# EAGLE design Page1 (EAGLE 4.16)
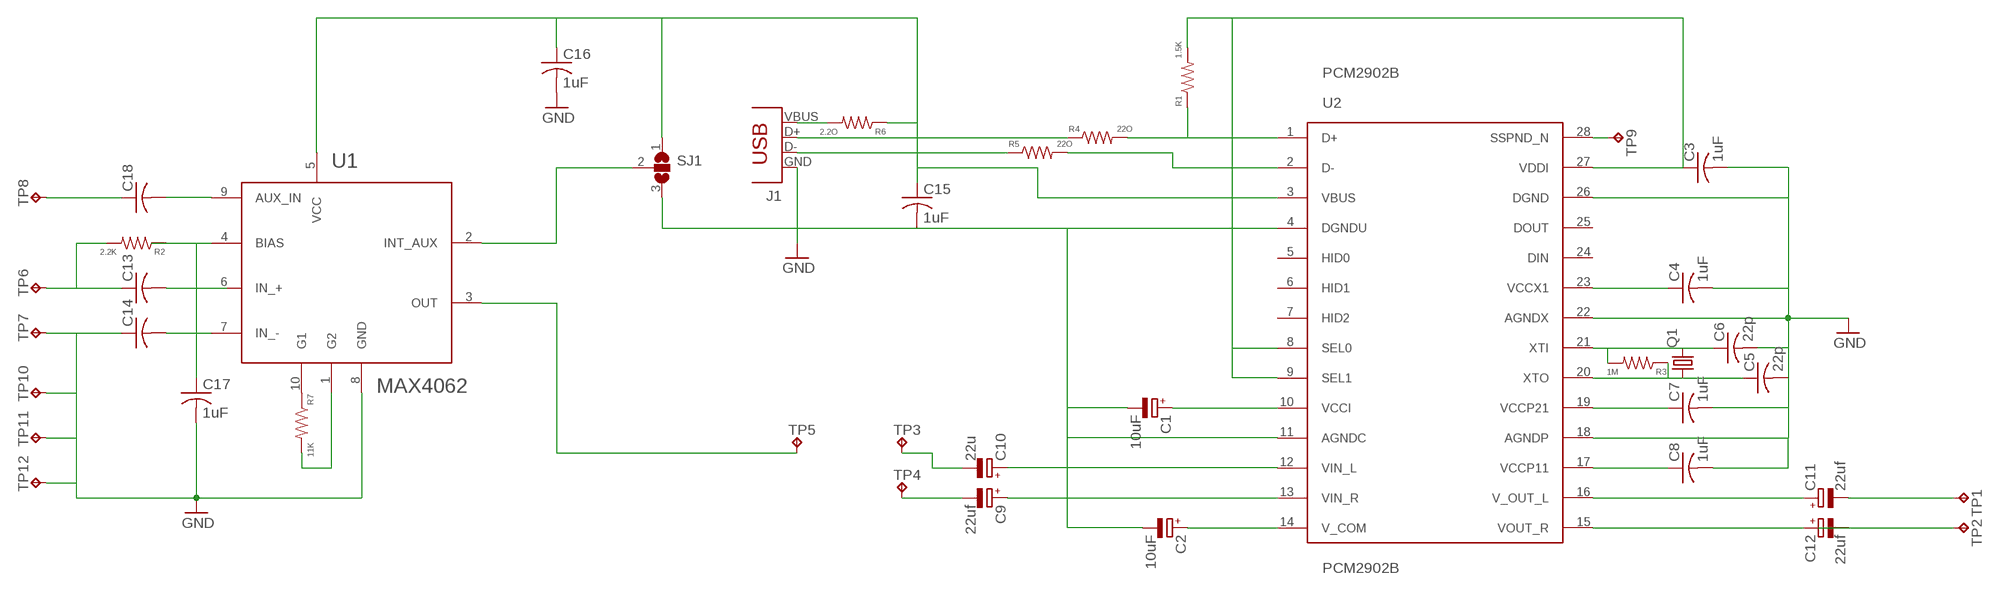
[diagram p0: schematic, sheet 1]

## Parts
C1  10uF  CPOL-EUSMCA  [SMC_A]
C2  10uF  CPOL-EUSMCA  [SMC_A]
C3  1uF  C-USC0805  [C0805]
C4  1uF  C-USC0805  [C0805]
C5  22p  C-USC1206  [C1206]
C6  22p  C-USC1206  [C1206]
C7  1uF  C-USC0805  [C0805]
C8  1uF  C-USC0805  [C0805]
C9  22uf  CPOL-EUSMCB  [SMC_B]
C10  22u  CPOL-EUSMCB  [SMC_B]
C11  22uf  CPOL-EUSMCB  [SMC_B]
C12  22uf  CPOL-EUSMCB  [SMC_B]
C13  C-USC0603  [C0603]
C14  C-USC0603  [C0603]
C15  1uF  C-USC0805  [C0805]
C16  1uF  C-USC0805  [C0805]
C17  1uF  C-USC0805  [C0805]
C18  C-USC0603  [C0603]
J1  USB_BHOR  [USB_B-HOR]
Q1  CRYSTALHC49S  [HC49/S]
R1  1.5K  R-US_R0805  [R0805]
R2  2.2K  R-US_R0805  [R0805]
R3  1M  R-US_R0603  [R0603]
R4  22O  R-US_R0805  [R0805]
R5  22O  R-US_R0805  [R0805]
R6  2.2O  R-US_R0805  [R0805]
R7  11K  R-US_R0603  [R0603]
SJ1  SJ2W  [SJ_2]
TP1  TPPAD1-13  [P1-13]
TP2  TPPAD1-13  [P1-13]
TP3  TPPAD1-13  [P1-13]
TP4  TPPAD1-13  [P1-13]
TP5  TPPAD1-13  [P1-13]
TP6  TPPAD1-13  [P1-13]
TP7  TPPAD1-13  [P1-13]
TP8  TPPAD1-13  [P1-13]
TP9  TPPAD1-13  [P1-13]
TP10  TPPAD1-13  [P1-13]
TP11  TPPAD1-13  [P1-13]
TP12  TPPAD1-13  [P1-13]
U1  MAX4062  [UMAX_10]
U2  PCM2902B  [SSOP28DB]

## Nets
AUX_IN: C18.2 U1.9(AUX_IN)
D+: R1.1 R4.2 U2.1(D+)
D+IN: J1.D+ R4.1
D-: R5.2 U2.2(D-)
GND: C1.- C2.- C3.2 C4.2 C5.2 C6.2 C7.2 C8.2 C14.1 C15.2 C16.2 C17.2 J1.GND SJ1.3 TP7.1(TP) TP10.1(TP) TP11.1(TP) TP12.1(TP) U1.8(GND) U2.4(DGNDU) U2.11(AGNDC) U2.18(AGNDP) U2.22(AGNDX) U2.26(DGND)
INT_AUX: SJ1.2 U1.2(INT_AUX)
N$1: C6.1 Q1.2 R3.2 U2.21(XTI)
N$2: C5.1 Q1.1 R3.1 U2.20(XTO)
N$3: J1.D- R5.1
N$4: C4.1 U2.23(VCCX1)
N$5: C7.1 U2.19(VCCP21)
N$6: TP9.1(TP) U2.28(SSPND_N)
N$7: C8.1 U2.17(VCCP11)
N$8: C11.+ U2.16(V_OUT_L)
N$12: C3.1 R1.2 U2.8(SEL0) U2.9(SEL1) U2.27(VDDI)
N$13: C11.- TP1.1(TP)
N$15: C1.+ U2.10(VCCI)
N$16: C2.+ U2.14(V_COM)
N$17: C10.+ U2.12(VIN_L)
N$18: C9.+ U2.13(VIN_R)
N$19: C12.+ U2.15(VOUT_R)
N$20: C12.- TP2.1(TP)
N$22: C10.- TP3.1(TP)
N$23: C9.- TP4.1(TP)
N$24: C13.2 U1.6(IN_+)
N$25: C14.2 U1.7(IN_-)
N$26: C13.1 R2.2 TP6.1(TP)
N$27: C17.1 R2.1 U1.4(BIAS)
N$28: R7.1 U1.10(G1)
N$29: R7.2 U1.1(G2)
N$31: C18.1 TP8.1(TP)
PRE_OUT: TP5.1(TP) U1.3(OUT)
VBUS: C15.1 C16.1 R6.1 SJ1.1 U1.5(VCC) U2.3(VBUS)
VBUS_IN: J1.VBUS(V_BUS) R6.2
Unconnected: U2.5(HID0) U2.6(HID1) U2.7(HID2) U2.24(DIN) U2.25(DOUT)

## Library data of the parts
C1 C2 C9-C12 = rcl:CPOL-EU: POLARIZED CAPACITOR, European symbol
C3-C8 C13-C18 = rcl:C-US: CAPACITOR, American symbol
J1 = Stofer:USB_B: BERG USB connector
Q1 = crystal:CRYSTAL: CRYSTAL
R1-R7 = rcl:R-US_: RESISTOR, American symbol
SJ1 = jumper:SJ2W: SMD solder JUMPER
TP1-TP12 = Stofer:TP
U1 = Stofer:MAX4062
U2 = Stofer:PCM2902B

## Board
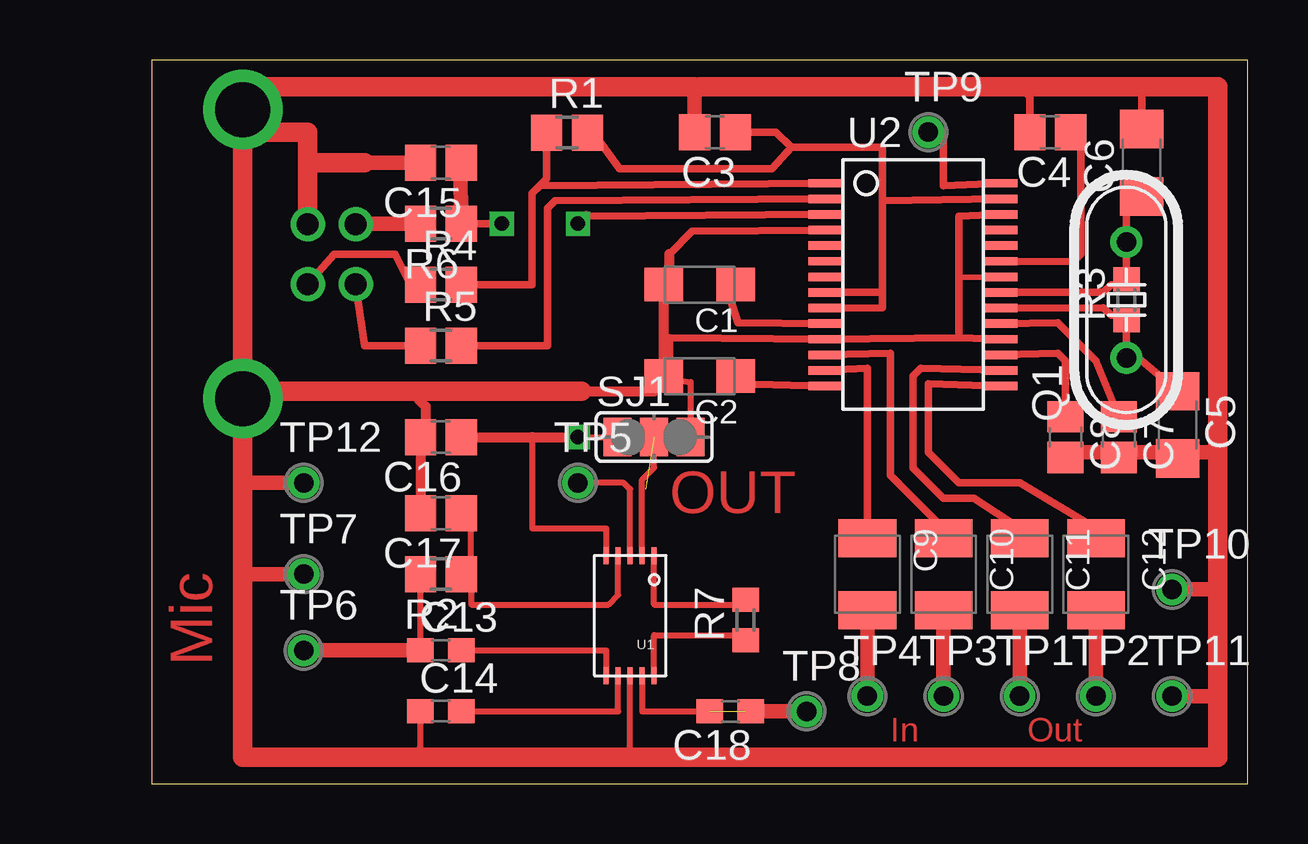
[diagram p1: board, top side]
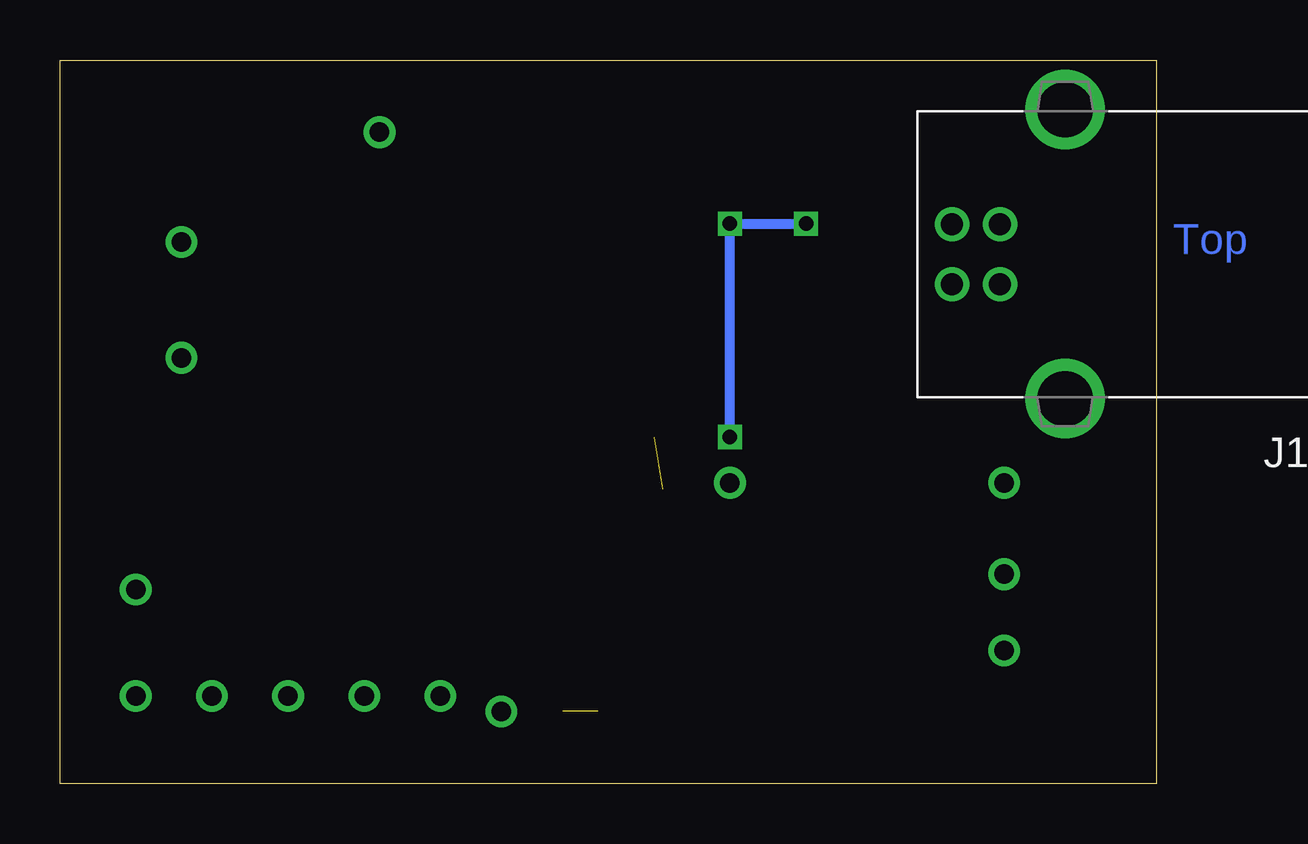
[diagram p2: board, bottom side, seen from below]

Size 45.7 x 30.15 mm. Coordinates in mm from the lower left corner, seen from the top.
Outline: 0,0 45.7,0 45.7,30.15 0,30.15 0,0
Copper layers (1*2+15*16): Top 0.035mm / dielectric 0.2mm / Route2 0.035mm / dielectric 0.15mm / Route15 0.035mm / dielectric 0.2mm / Bottom 0.035mm
Design rules "default": minimum track width 10mil, minimum drill 24mil, track to track 8mil, track to pad 8mil, pad to pad 8mil, via to via 8mil, smd to smd 8mil, copper to edge 40mil, drill to drill 8mil, minimum pad ring 10mil, minimum via ring 8mil, stop-mask expansion 4mil, vias tented up to drill 0mil, thermal gap 10mil

### Footprints (pad centres in the part's own frame; a part is rotated, then mirrored left to right if it is on the bottom)
SMC_A = smd 1.6 x 1.4: + -1.5,0; - 1.5,0
C0805 = smd 1.3 x 1.5: 1 -0.85,0; 2 0.85,0
C1206 = smd 1.6 x 1.8: 1 -1.4,0; 2 1.4,0
SMC_B = smd 1.6 x 2.4: + -1.5,0; - 1.5,0
C0603 = smd 1.1 x 1: 1 -0.85,0; 2 0.85,0
USB_B-HOR = drill 0.92 pad 1.27 round: D+ 2.71,1.25; D- 4.71,1.25; GND 2.71,-1.25; VBUS 4.71,-1.25 | drill 2.3 pad 3 round: M1 0,6.02; M2 0,-6.02
HC49/S = drill 0.813 round: 1 -2.413,0; 2 2.413,0
R0805 = smd 1.3 x 1.5: 1 -0.85,0; 2 0.85,0
R0603 = smd 1 x 1.1: 1 -0.85,0; 2 0.85,0
SJ_2 = smd 1.168 x 1.6: 1 -1.524,0; 2 0,0; 3 1.524,0
P1-13 = drill 0.813 round: 1 0,0
UMAX_10 = smd 0.2 x 0.7: 1 0,0.5; 2 0.5,0.5; 3 1,0.5; 4 1.5,0.5; 5 2,0.5; 6 2,5.5; 7 1.5,5.5; 8 1,5.5; 9 0.5,5.5; 10 0,5.5
SSOP28DB = smd 0.348 x 1.397: 1 -4.225,-3.656; 2 -3.575,-3.656; 3 -2.925,-3.656; 4 -2.275,-3.656; 5 -1.625,-3.656; 6 -0.975,-3.656; 7 -0.325,-3.656; 8 0.325,-3.656; 9 0.975,-3.656; 10 1.625,-3.656; 11 2.275,-3.656; 12 2.925,-3.656; 13 3.575,-3.656; 14 4.225,-3.656; 15 4.225,3.656; 16 3.575,3.656; 17 2.925,3.656; 18 2.275,3.656; 19 1.625,3.656; 20 0.975,3.656; 21 0.325,3.656; 22 -0.325,3.656; 23 -0.975,3.656; 24 -1.625,3.656; 25 -2.275,3.656; 26 -2.925,3.656; 27 -3.575,3.656; 28 -4.225,3.656

### Placement (x,y rotation side)
C1  22.86,20.79 180 top
C2  22.86,16.98 180 top
C3  23.49,27.14 180 top
C4  37.46,27.14 180 top
C5  42.77,14.95 270 top
C6  41.27,25.87 90 top
C7  40.32,14.44 270 top
C8  38.09,14.44 270 top
C9  29.84,8.72 270 top
C10  33.02,8.72 270 top
C11  36.19,8.72 270 top
C12  39.36,8.72 270 top
C13  12.06,5.55 0 top
C14  12.06,3.01 0 top
C15  12.06,25.87 180 top
C16  12.06,14.44 180 top
C17  12.06,11.27 180 top
C18  24.12,3.01 180 top
J1  3.81,22.06 180 bottom
Q1  40.63,20.16 90 top
R1  17.32,27.13 0 top
R2  12.06,8.72 180 top
R3  40.63,20.16 90 top
R4  12.06,20.79 0 top
R5  12.06,18.25 0 top
R6  12.06,23.33 180 top
R7  24.76,6.82 90 top
SJ1  20.95,14.44 0 top
TP1  36.19,3.64 0 top
TP2  39.36,3.64 0 top
TP3  33.02,3.64 0 top
TP4  29.84,3.64 0 top
TP5  17.78,12.54 0 top
TP6  6.34,5.55 0 top
TP7  6.34,8.72 0 top
TP8  27.3,3.01 0 top
TP9  32.38,27.14 0 top
TP10  42.54,8.09 0 top
TP11  42.54,3.64 0 top
TP12  6.34,12.54 0 top
U1  20.95,10 180 top
U2  31.75,20.79 270 top

### Tracks (layer width: path | path; a pad name or v marks a point on that pad's centre or on a via)
AUX_IN  (1 unrouted)
  Top 0.254: U1.9 20.45,3.01 C18.2
D+
  Top 0.305: R4.2 15.87,20.79 15.87,24.6 | U2.1 16.19,24.92 15.87,24.6 | R1.1 16.47,25.2 15.87,24.6
D+IN
  Top 0.305: R4.1 10.79,20.79 10.16,22.06 7.61,22.06 J1.D+ 6.34,20.79
D-
  Top 0.305: R5.2 16.5,18.25 16.5,23.96 16.82,24.28 U2.2
GND
  Top 0.254: 33.65,20.79 33.65,21.11 U2.22 | U1.8 19.95,1.37 19.68,1.1 | C14.1 11.21,1.52 10.79,1.1 | C2.- 20.95,16.98 22.47,16.73 SJ1.3
  Top 0.305: U2.4 22.54,23.01 21.59,22.06 | 33.65,18.57 U2.11 21.59,18.57 21.59,16.98 | 33.65,18.57 U2.18 | 33.65,18.57 33.65,20.79 33.65,23.65 U2.26 | C4.2 36.61,28.62 36.19,29.05 | 41.27,29.05 C6.2
  Top 0.406: C1.- 21.36,17.21 21.59,16.98 | C1.- 21.36,21.02 | C1.- 21.59,20.79 21.59,22.06 | 21.59,16.98 C2.- | 17.92,16.34 20.95,16.34 21.59,16.98 | 12.06,16.34 11.21,16.13 | 11.43,14.44 11.04,14.06 | 11.43,14.44 11.43,15.71 10.79,16.34 | 10.79,14.44 C16.2 11.43,14.44 | C17.2 11.21,14.22 11.43,14.44
  Top 0.61: 8.89,25.87 C15.2 | C8.2 38.31,13.8 40.63,13.8 C7.2 40.85,13.8 43.17,13.8 C5.2 43.68,13.8 44.45,13.8 | 22.64,29.05 C3.2 | 44.45,8.09 TP10.1 | 44.45,3.64 TP11.1 | 3.81,12.54 TP12.1 | 3.81,8.72 TP7.1
  Top 0.813: 6.51,25.87 6.51,27.14 3.81,27.14 | 6.51,25.87 J1.GND | 7.61,25.87 8.89,25.87 6.51,25.87 | 3.81,16.34 3.81,12.54 3.81,8.72 3.81,1.1 10.79,1.1 19.68,1.1 44.45,1.1 44.45,3.64 44.45,8.09 44.45,13.8 44.45,29.05 41.27,29.05 36.19,29.05 22.86,29.05 | 3.81,16.34 3.81,27.14 | 3.81,16.34 10.79,16.34 12.06,16.34 17.92,16.34 | 22.64,29.05 3.81,29.05 3.81,27.14
INT_AUX  (1 unrouted)
  Top 0.254: U1.2 20.45,12.67 20.95,13.17 SJ1.2
N$1
  Top 0.305: U2.21 39.68,20.47 40,20.79 40.63,20.79 R3.2 Q1.2 | Q1.2 40.63,22.7 | C6.1 41.27,24.6 40.63,23.96 Q1.2
N$2
  Top 0.305: C5.1 41.27,17.62 Q1.1 R3.1 40.63,19.52 40,19.52 39.68,19.84 U2.20
N$3
  Top 0.305: R5.1 8.89,18.25 8.52,20.79
  Top 0.406: J1.D- 8.27,20.81 8.25,20.79 8.52,20.79
N$4
  Top 0.305: U2.23 38.41,21.74 38.73,22.06 38.73,26.51 C4.1
N$5
  Top 0.305: U2.19 37.78,19.2 39.36,17.62 C7.1
N$6
  Top 0.305: U2.28 33.02,24.92 33.02,27.14 TP9.1
N$7
  Top 0.305: C8.1 38.09,17.62 37.78,17.93 U2.17
N$8
  Top 0.305: U2.16 32.06,17.3 31.75,16.98 31.75,13.17 33.02,11.9 34.28,11.9 36.19,10.63 C11.+
N$12
  Top 0.305: U2.8 30.47,20.47 30.47,20.79 | U2.9 30.47,19.84 30.47,20.79 | 30.47,24.6 30.47,20.79 | 30.47,24.6 30.47,26.51 26.66,26.51 | U2.27 30.47,24.28 30.47,24.6 | 26.66,26.51 25.85,25.62 19.5,25.62 18.41,27.14 18.4,27.13 R1.2 | C3.1 26.03,27.14 26.66,26.51
N$13
  Top 0.61: TP1.1 C11.-
N$15
  Top 0.305: U2.10 24.44,19.2 24.12,20.16
  Top 0.406: 24.12,20.16 C1.+
N$16
  Top 0.305: C2.+ 24.76,16.98 24.44,16.66 U2.14
N$17
  Top 0.305: U2.12 30.79,17.93 30.79,12.85 33.02,10.63 C10.+
N$18
  Top 0.305: 29.84,10 C9.+ 29.84,17.3 U2.13
N$19
  Top 0.305: U2.15 32.38,16.66 32.38,13.8 33.65,12.54 36.19,12.54 39.36,10.63 C12.+
N$20
  Top 0.61: TP2.1 C12.-
N$22
  Top 0.61: TP3.1 C10.-
N$23
  Top 0.61: TP4.1 C9.-
N$24
  Top 0.254: 12.7,5.55 C13.2 18.95,5.55 U1.6
N$25
  Top 0.254: C14.2 14.6,3.01 | 14.6,3.01 18.41,3.01 | U1.7 19.45,3.01 14.6,3.01
N$26
  Top 0.254: R2.2 11.43,8.72 11.21,8.51 C13.1
  Top 0.61: TP6.1 C13.1
N$27
  Top 0.254: U1.4 19.45,7.86 19.05,7.46 13.33,7.46 13.33,8.09 | C17.1 13.33,11.27 13.33,8.09 | R2.1 13.33,8.72 13.33,8.09
N$28
  Top 0.254: U1.10 20.95,6.18 24.76,6.18 R7.1
N$29
  Top 0.254: U1.1 20.95,7.46 24.76,7.46 R7.2
N$31
  Top 0.61: C18.1 TP8.1
PRE_OUT
  Top 0.254: U1.3 19.95,12.27 19.68,12.54 TP5.1
VBUS  (via drill 0.6)
  Top 0.254: v17.78,14.44 SJ1.1 | 15.78,14.35 15.87,14.44 15.87,10.63 18.95,10.63 U1.5
  Top 0.305: v14.6,23.33 R6.1 | 18.09,23.65 U2.3
  Top 0.406: v17.78,23.33 18.09,23.65 | C16.1 15.87,14.44 v17.78,14.44
  Top 0.61: R6.1 12.88,25.69
  Top 0.813: 12.88,25.69 C15.1
  Bottom 0.305: v17.78,23.33 v14.6,23.33
  Bottom 0.406: v14.6,23.33 v17.78,23.33 v17.78,14.44
VBUS_IN
  Top 0.61: 8.52,23.33 R6.2
  Top 0.813: J1.VBUS 8.52,23.33

### Text on the board
Top: OUT | Mic | In | Out